# EAGLE schematic fet_switch (EAGLE 6.4)
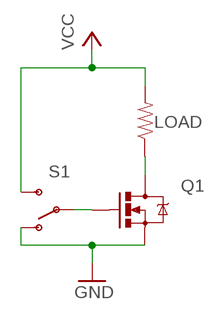
[diagram p0: schematic, sheet 1]

## Parts
LOAD  RESISTOR0402-RES  [0402-RES]
Q1  MOSFET-NCHANNEL2N7000  [TO-92]
S1  SWITCH-SPDT-SMD-A  [SWITCH-SPST-SMD-A]

## Nets
GND: Q1.1(S) S1.1(O)
N$3: Q1.2(G) S1.2(P)
N$4: LOAD.1 Q1.3(D)
VCC: LOAD.2 S1.3(S)

## Library data of the parts
LOAD = SparkFun-Passives:RESISTOR: Resistor Basic schematic elements and footprints for 0603, 1206, and PTH resistors.
Q1 = SparkFun-DiscreteSemi:MOSFET-NCHANNEL: Common NMOSFET Parts MFG P/N Store ID Prod ID FDD8780 TRANS-09984 SI7820DN TRANS-11055 FDS6630A IC-08089 2N7002PW TRANS-11151 FQP30N06L COM-10213 TRANS-10060 BSS123LT1G TRANS-08345 BSS138 TRANS-00830 BS170 2N7000
S1 = SparkFun-Electromechanical:SWITCH-SPDT: SPDT Switch Simple slide switch, Spark Fun Electronics SKU : COM-00102 DPDT SMT slide switch, AYZ0202, SWCH-08179